# Altium schematic sheet 海关全向控制器主控板电路V3_主控芯片.SchDoc
size A4
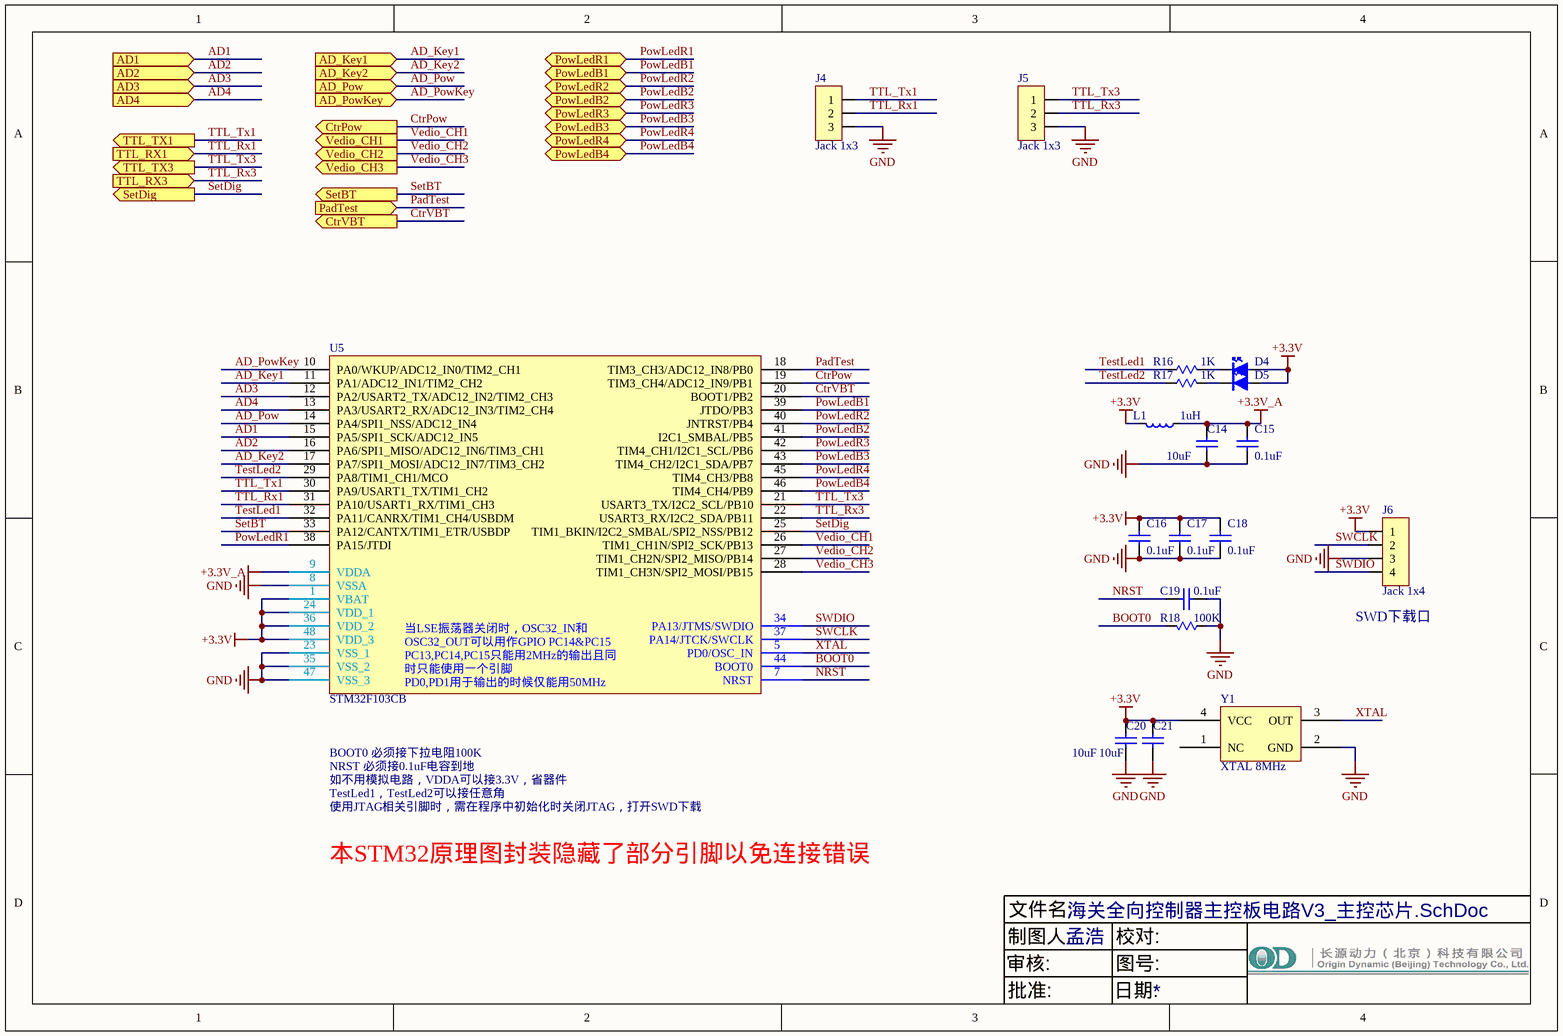
[diagram p0: 海关全向控制器主控板电路V3_主控芯片.SchDoc]

## Parts
C14  10uF  [C0805]
C15  0.1uF  [C0805]
C16  0.1uF  [C0805]
C17  0.1uF  [C0805]
C18  0.1uF  [C0805]
C19  0.1uF  [C0805]
C20  10uF  [C0805]
C21  10uF  [C0805]
D4  LED  [LED0603]  (value not drawn)
D5  LED  [LED0603]  (value not drawn)
J4  Jack 1x3  [Jk1*3-2.0]
J5  Jack 1x3  [Jk1*3-2.0]
J6  Jack 1x4  [Jk1*4-2.0]
L1  1uH  [L0805]
R16  1K  [R0805]
R17  1K  [R0805]
R18  100K  [R0805]
U5  STM32F103CB  [LQF48]
Y1  XTAL 8MHz  [XTAL5032]

## Ports
AD1 (in), AD2 (in), AD3 (in), AD4 (in), AD_Key1 (in), AD_Key2 (in), AD_Pow (in), AD_PowKey (in), CtrPow (out), CtrVBT (out), PadTest (in), PowLedB1 (bidir), PowLedB2 (bidir), PowLedB3 (bidir), PowLedB4 (bidir), PowLedR1 (bidir), PowLedR2 (bidir), PowLedR3 (bidir), PowLedR4 (bidir), SetBT (out), SetDig (out), TTL_RX1 (in), TTL_RX3 (in), TTL_TX1 (out), TTL_TX3 (out), Vedio_CH1 (out), Vedio_CH2 (out), Vedio_CH3 (out)

## Nets
+3.3V: C16.1 C17.1 C18.1 C20.2 C21.2 D4.1(A) D5.1(A) J6.1 L1.1 U5.1(VBAT) U5.24(VDD_1) U5.36(VDD_2) U5.48(VDD_3) Y1.4(VCC)
+3.3V_A: C14.2 C15.1 L1.2 U5.9(VDDA)
GND: C14.1 C15.2 C16.2 C17.2 C18.2 C19.2 C20.1 C21.1 J4.3 J5.3 J6.3 R18.1 U5.8(VSSA) U5.23(VSS_1) U5.35(VSS_2) U5.47(VSS_3) Y1.2(GND)
AD1: U5.15(PA5/SPI1_SCK/ADC12_IN5) ; port AD1
AD2: U5.16(PA6/SPI1_MISO/ADC12_IN6/TIM3_CH1) ; port AD2
AD3: U5.12(PA2/USART2_TX/ADC12_IN2/TIM2_CH3) ; port AD3
AD4: U5.13(PA3/USART2_RX/ADC12_IN3/TIM2_CH4) ; port AD4
AD_Key1: U5.11(PA1/ADC12_IN1/TIM2_CH2) ; port AD_Key1
AD_Key2: U5.17(PA7/SPI1_MOSI/ADC12_IN7/TIM3_CH2) ; port AD_Key2
AD_Pow: U5.14(PA4/SPI1_NSS/ADC12_IN4) ; port AD_Pow
AD_PowKey: U5.10(PA0/WKUP/ADC12_IN0/TIM2_CH1) ; port AD_PowKey
BOOT0: R18.2 U5.44(BOOT0)
CtrPow: U5.19(TIM3_CH4/ADC12_IN9/PB1) ; port CtrPow
CtrVBT: U5.20(BOOT1/PB2) ; port CtrVBT
NRST: C19.1 U5.7(NRST)
PadTest: U5.18(TIM3_CH3/ADC12_IN8/PB0) ; port PadTest
PowLedB1: U5.39(JTDO/PB3) ; port PowLedB1
PowLedB2: U5.41(I2C1_SMBAL/PB5) ; port PowLedB2
PowLedB3: U5.43(TIM4_CH2/I2C1_SDA/PB7) ; port PowLedB3
PowLedB4: U5.46(TIM4_CH4/PB9) ; port PowLedB4
PowLedR1: U5.38(PA15/JTDI) ; port PowLedR1
PowLedR2: U5.40(JNTRST/PB4) ; port PowLedR2
PowLedR3: U5.42(TIM4_CH1/I2C1_SCL/PB6) ; port PowLedR3
PowLedR4: U5.45(TIM4_CH3/PB8) ; port PowLedR4
SetBT: U5.33(PA12/CANTX/TIM1_ETR/USBDP) ; port SetBT
SetDig: U5.25(TIM1_BKIN/I2C2_SMBAL/SPI2_NSS/PB12) ; port SetDig
SWCLK: J6.2 U5.37(PA14/JTCK/SWCLK)
SWDIO: J6.4 U5.34(PA13/JTMS/SWDIO)
TestLed1: R16.1 U5.32(PA11/CANRX/TIM1_CH4/USBDM)
TestLed2: R17.1 U5.29(PA8/TIM1_CH1/MCO)
TTL_Rx1: J4.2 U5.31(PA10/USART1_RX/TIM1_CH3) ; port TTL_RX1
TTL_Rx3: J5.2 U5.22(USART3_RX/I2C2_SDA/PB11) ; port TTL_RX3
TTL_Tx1: J4.1 U5.30(PA9/USART1_TX/TIM1_CH2) ; port TTL_TX1
TTL_Tx3: J5.1 U5.21(USART3_TX/I2C2_SCL/PB10) ; port TTL_TX3
Vedio_CH1: U5.26(TIM1_CH1N/SPI2_SCK/PB13) ; port Vedio_CH1
Vedio_CH2: U5.27(TIM1_CH2N/SPI2_MISO/PB14) ; port Vedio_CH2
Vedio_CH3: U5.28(TIM1_CH3N/SPI2_MOSI/PB15) ; port Vedio_CH3
XTAL: U5.5(PD0/OSC_IN) Y1.3(OUT)
NetD4_2: D4.2(K) R16.2
NetD5_2: D5.2(K) R17.2

Not connected (* = marked no-connect by the designer): U5 2(PC13-TAMPER-RTC) 3(PC14-OSC32_IN) 4(PC15-OSC32_OUT) 6(PD1/OSC_OUT); Y1 1(NC)

## Notes on the sheet
- (near J6) SWD下载口
- BOOT0 必须接下拉电阻100K
- NRST 必须接0.1uF电容到地
- 如不用模拟电路，VDDA可以接3.3V，省器件
- TestLed1，TestLed2可以接任意角
- 使用JTAG相关引脚时，需在程序中初始化时关闭JTAG，打开SWD下载
- 本STM32原理图封装隐藏了部分引脚以免连接错误
- 文件名:
- 审核:
- 制图人:
- 孟浩
- 校对:
- 图号:
- 批准:
- 日期:
- (in symbol STM32F103Cx) OSC32_IN和OSC32_OUT可以用作通用IO PC14和PC15; PC13,PC14,PC15只能用于2MHz的输出模式且同时只能使用一个引脚; 当LSE振荡器关闭时，OSC32_IN和OSC32_OUT可以用作GPIO PC14&PC15 / PC13,PC14,PC15只能用2MHz的输出且同时只能使用一个引脚 / PD0,PD1用于输出的时候仅能用50MHz

## Library data of the parts
C14-C21 = Cap: Capacitor; Published: 8-Jun-2000; Publisher: Altium Limited
  C14 C20 C21: LatestRevisionDate: 17-Jul-2002; LatestRevisionNote: Re-released for DXP Platform.; PackageReference: RAD-0.3; Value: 10uF
  C15-C19: Revision: July-2002: Re-released for DXP Platform.; Value: 0.1uF
J4 J5 = Jack 1x3: 插座
J6 = Jack 1x4: 插座
L1 = INDUCTOR: Code_IEC: 1005; Published: 8-Jun-2000; LatestRevisionDate: 17-Jul-2002; LatestRevisionNote: Re-released for DXP Platform.; PackageReference: 0402-A; Publisher: Altium Limited; Code_JEITA: 0402; Value: 1uH
R16 R17 = Res: Resistor; Published: 8-Jun-2000; LatestRevisionDate: 04-Mar-2005; LatestRevisionNote: PCB Footprint replaced.; PackageReference: J1-0603; Publisher: Altium Limited; Value: 1K
R18 = RES: Resistor; Published: 8-Jun-2000; LatestRevisionDate: 17-Jul-2002; LatestRevisionNote: Re-released for DXP Platform.; PackageReference: AXIAL-0.3; Publisher: Altium Limited; Value: 100K
U5 = STM32F103Cx
Y1 = XTAL